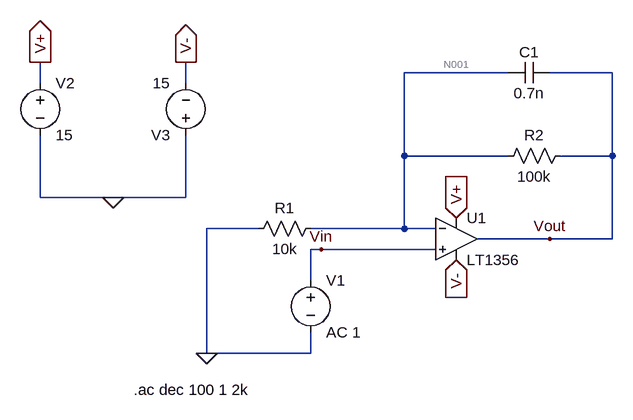
[diagram p0: schematic TP1.asc]
TP1.asc, the LTspice schematic file:
Version 4
SHEET 1 880 680
WIRE 336 -96 176 -96
WIRE 496 -96 400 -96
WIRE -384 -80 -384 -112
WIRE -160 -80 -160 -112
WIRE 176 32 176 -96
WIRE 336 32 176 32
WIRE 496 32 496 -96
WIRE 496 32 416 32
WIRE -384 96 -384 0
WIRE -272 96 -384 96
WIRE -160 96 -160 0
WIRE -160 96 -272 96
WIRE -48 144 -128 144
WIRE 176 144 176 32
WIRE 176 144 32 144
WIRE 224 144 176 144
WIRE 400 160 288 160
WIRE 496 160 496 32
WIRE 496 160 400 160
WIRE 48 176 32 176
WIRE 224 176 48 176
WIRE 32 224 32 176
WIRE -128 336 -128 144
WIRE 32 336 32 304
WIRE 32 336 -128 336
FLAG -384 -112 V+
IOPIN -384 -112 Out
FLAG -160 -112 V-
IOPIN -160 -112 Out
FLAG -272 96 0
FLAG -128 336 0
FLAG 256 128 V+
IOPIN 256 128 In
FLAG 256 192 V-
IOPIN 256 192 In
FLAG 48 176 Vin
FLAG 400 160 Vout
SYMBOL OpAmps\\LT1356 256 96 R0
SYMATTR InstName U1
SYMBOL voltage 32 208 R0
WINDOW 123 0 0 Left 0
WINDOW 39 0 0 Left 0
SYMATTR InstName V1
SYMATTR Value AC 1
SYMBOL voltage -384 -96 R0
WINDOW 123 0 0 Left 0
WINDOW 39 0 0 Left 0
SYMATTR InstName V2
SYMATTR Value 15
SYMBOL voltage -160 16 R180
WINDOW 123 0 0 Left 0
WINDOW 39 0 0 Left 0
SYMATTR InstName V3
SYMATTR Value 15
SYMBOL res 48 128 R90
WINDOW 0 0 56 VBottom 2
WINDOW 3 32 56 VTop 2
SYMATTR InstName R1
SYMATTR Value 10k
SYMBOL res 432 16 R90
WINDOW 0 0 56 VBottom 2
WINDOW 3 32 56 VTop 2
SYMATTR InstName R2
SYMATTR Value 100k
SYMBOL cap 400 -112 R90
WINDOW 0 0 32 VBottom 2
WINDOW 3 32 32 VTop 2
SYMATTR InstName C1
SYMATTR Value 0.7n
TEXT -240 392 Left 2 !.ac dec 100 1 2k

The netlist it stands for:
* TP1.asc
XU1 Vin N001 V+ V- Vout LT1356  ; pins In+ In- V+ V- OUT
V1 Vin 0 AC 1
V2 V+ 0 15
V3 0 V- 15
R1 N001 0 10k
R2 Vout N001 100k
C1 Vout N001 0.7n
.ac dec 100 1 2k
.backanno
.end

* Results of the author's LTspice run, read from the files saved beside the schematic
* Operating Point, zero values left out:
*   V(n001) = -223.7 nV
*   V(v+) = 15 V
*   V(vout) = 8.058 mV
*   V(v-) = -15 V
*   I(R2) = 80.58 nA
*   I(R1) = -22.37 pA
*   I(V3) = -994.3 µA
*   I(V2) = -994.2 µA
*   I(V1) = -80.6 nA
*   Ix(u1:1) = 80.6 nA
*   Ix(u1:2) = 80.6 nA
*   Ix(u1:3) = 994.2 µA
*   Ix(u1:4) = -994.3 µA
*   Ix(u1:5) = -80.58 nA
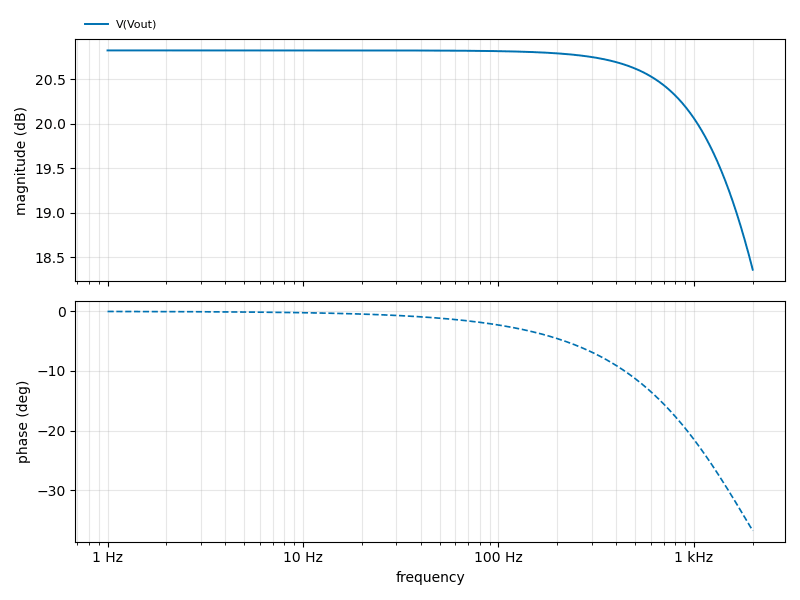
[diagram p1: AC Analysis of TP1.asc, plotted from the saved traces]
* AC Analysis, 1 run:
*   V(Vout): 20.83 dB at 1 Hz, 18.36 dB at 2 kHz, peak 20.83 dB at 1 Hz